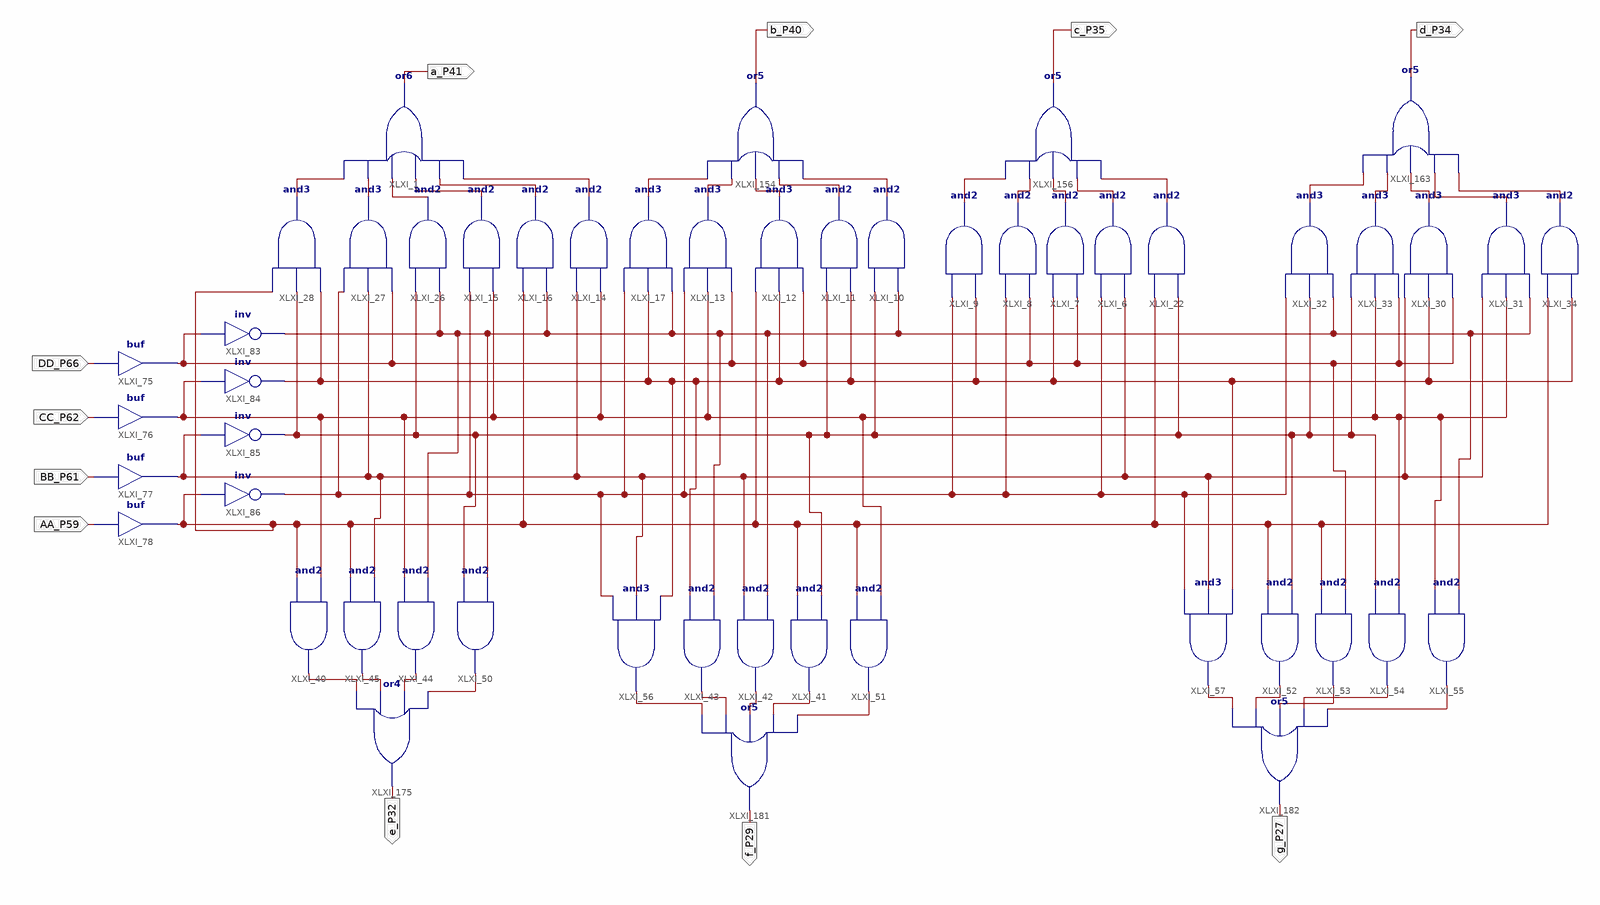
[diagram p0: schematic sheet 1]
// Xilinx ISE schematic SevenSig.sch (spartan6) as structural Verilog: 50 symbols, 11 ports
module SevenSig (
  input  AA_P59,
  input  BB_P61,
  input  CC_P62,
  input  DD_P66,
  output a_P41,
  output b_P40,
  output c_P35,
  output d_P34,
  output e_P32,
  output f_P29,
  output g_P27
);

  wire A, Ainv, B, Binv, C, Cinv, D, Dinv, XLXN_1, XLXN_2, XLXN_3, XLXN_4, XLXN_5, XLXN_21, XLXN_22, XLXN_23,
       XLXN_24, XLXN_25, XLXN_26, XLXN_27, XLXN_29, XLXN_30, XLXN_31, XLXN_32, XLXN_33, XLXN_34, XLXN_35,
       XLXN_36, XLXN_37, XLXN_39, XLXN_40, XLXN_41, XLXN_42, XLXN_253, XLXN_254, XLXN_255, XLXN_256,
       XLXN_257, XLXN_258, XLXN_259, XLXN_260, XLXN_261, XLXN_262;

  and XLXI_57 (XLXN_5, Ainv, B, Cinv);
  and XLXI_55 (XLXN_2, C, Dinv);
  and XLXI_54 (XLXN_1, Binv, C);
  and XLXI_53 (XLXN_3, A, D);
  and XLXI_52 (XLXN_4, A, Binv);
  and XLXI_6 (XLXN_261, B, Ainv);
  and XLXI_7 (XLXN_260, D, Cinv);
  and XLXI_8 (XLXN_259, D, Ainv);
  and XLXI_9 (XLXN_258, Cinv, Ainv);
  and XLXI_10 (XLXN_257, Dinv, Binv);
  and XLXI_11 (XLXN_256, Cinv, Binv);
  and XLXI_12 (XLXN_255, D, Cinv, A);
  and XLXI_13 (XLXN_254, D, C, Ainv);
  buf XLXI_75 (D, DD_P66);
  buf XLXI_76 (C, CC_P62);
  not XLXI_84 (Cinv, C);
  buf XLXI_77 (B, BB_P61);
  not XLXI_85 (Binv, B);
  not XLXI_83 (Dinv, D);
  buf XLXI_78 (A, AA_P59);
  not XLXI_86 (Ainv, A);
  and XLXI_22 (XLXN_262, Binv, A);
  and XLXI_14 (XLXN_22, C, B);
  and XLXI_16 (XLXN_23, Dinv, A);
  and XLXI_15 (XLXN_24, C, Ainv);
  and XLXI_26 (XLXN_25, Dinv, Binv);
  and XLXI_27 (XLXN_26, D, B, Ainv);
  and XLXI_28 (XLXN_27, Cinv, Binv, A);
  or XLXI_1 (a_P41, XLXN_22, XLXN_23, XLXN_24, XLXN_25, XLXN_26, XLXN_27);
  and XLXI_17 (XLXN_253, Dinv, Cinv, Ainv);
  or XLXI_154 (b_P40, XLXN_257, XLXN_256, XLXN_255, XLXN_254, XLXN_253);
  and XLXI_32 (XLXN_21, Dinv, Binv, Ainv);
  and XLXI_31 (XLXN_32, Dinv, C, B);
  and XLXI_34 (XLXN_30, Cinv, A);
  and XLXI_30 (XLXN_31, D, Cinv, B);
  and XLXI_33 (XLXN_29, D, C, Binv);
  or XLXI_156 (c_P35, XLXN_262, XLXN_261, XLXN_260, XLXN_259, XLXN_258);
  or XLXI_163 (d_P34, XLXN_30, XLXN_32, XLXN_31, XLXN_29, XLXN_21);
  and XLXI_56 (XLXN_37, Ainv, B, Cinv);
  and XLXI_51 (XLXN_42, A, C);
  and XLXI_41 (XLXN_41, A, Binv);
  and XLXI_42 (XLXN_40, B, Dinv);
  and XLXI_43 (XLXN_39, Cinv, Dinv);
  and XLXI_44 (XLXN_35, C, Dinv);
  and XLXI_45 (XLXN_34, A, B);
  and XLXI_40 (XLXN_33, A, C);
  or XLXI_175 (e_P32, XLXN_33, XLXN_34, XLXN_35, XLXN_36);
  or XLXI_181 (f_P29, XLXN_37, XLXN_39, XLXN_40, XLXN_41, XLXN_42);
  or XLXI_182 (g_P27, XLXN_5, XLXN_4, XLXN_3, XLXN_1, XLXN_2);
  and XLXI_50 (XLXN_36, Binv, Dinv);
endmodule
